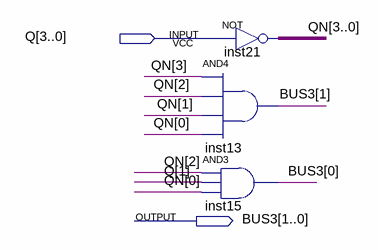
[diagram p0: schematic sheet]
// Quartus schematic BUS3.bdf as structural Verilog: 3 symbols, 2 pins
module BUS3 (
  input  [3:0] Q,
  output [1:0] BUS3
);

  wire [3:0] QN;

  assign QN = ~Q;  // NOT inst21, 4 bits wide
  and inst13 (BUS3[1], QN[3], QN[2], QN[1], QN[0]);
  and inst15 (BUS3[0], QN[2], Q[1], QN[0]);
endmodule
